# EAGLE design picoAvaRev2-1 (EAGLE 6.2)
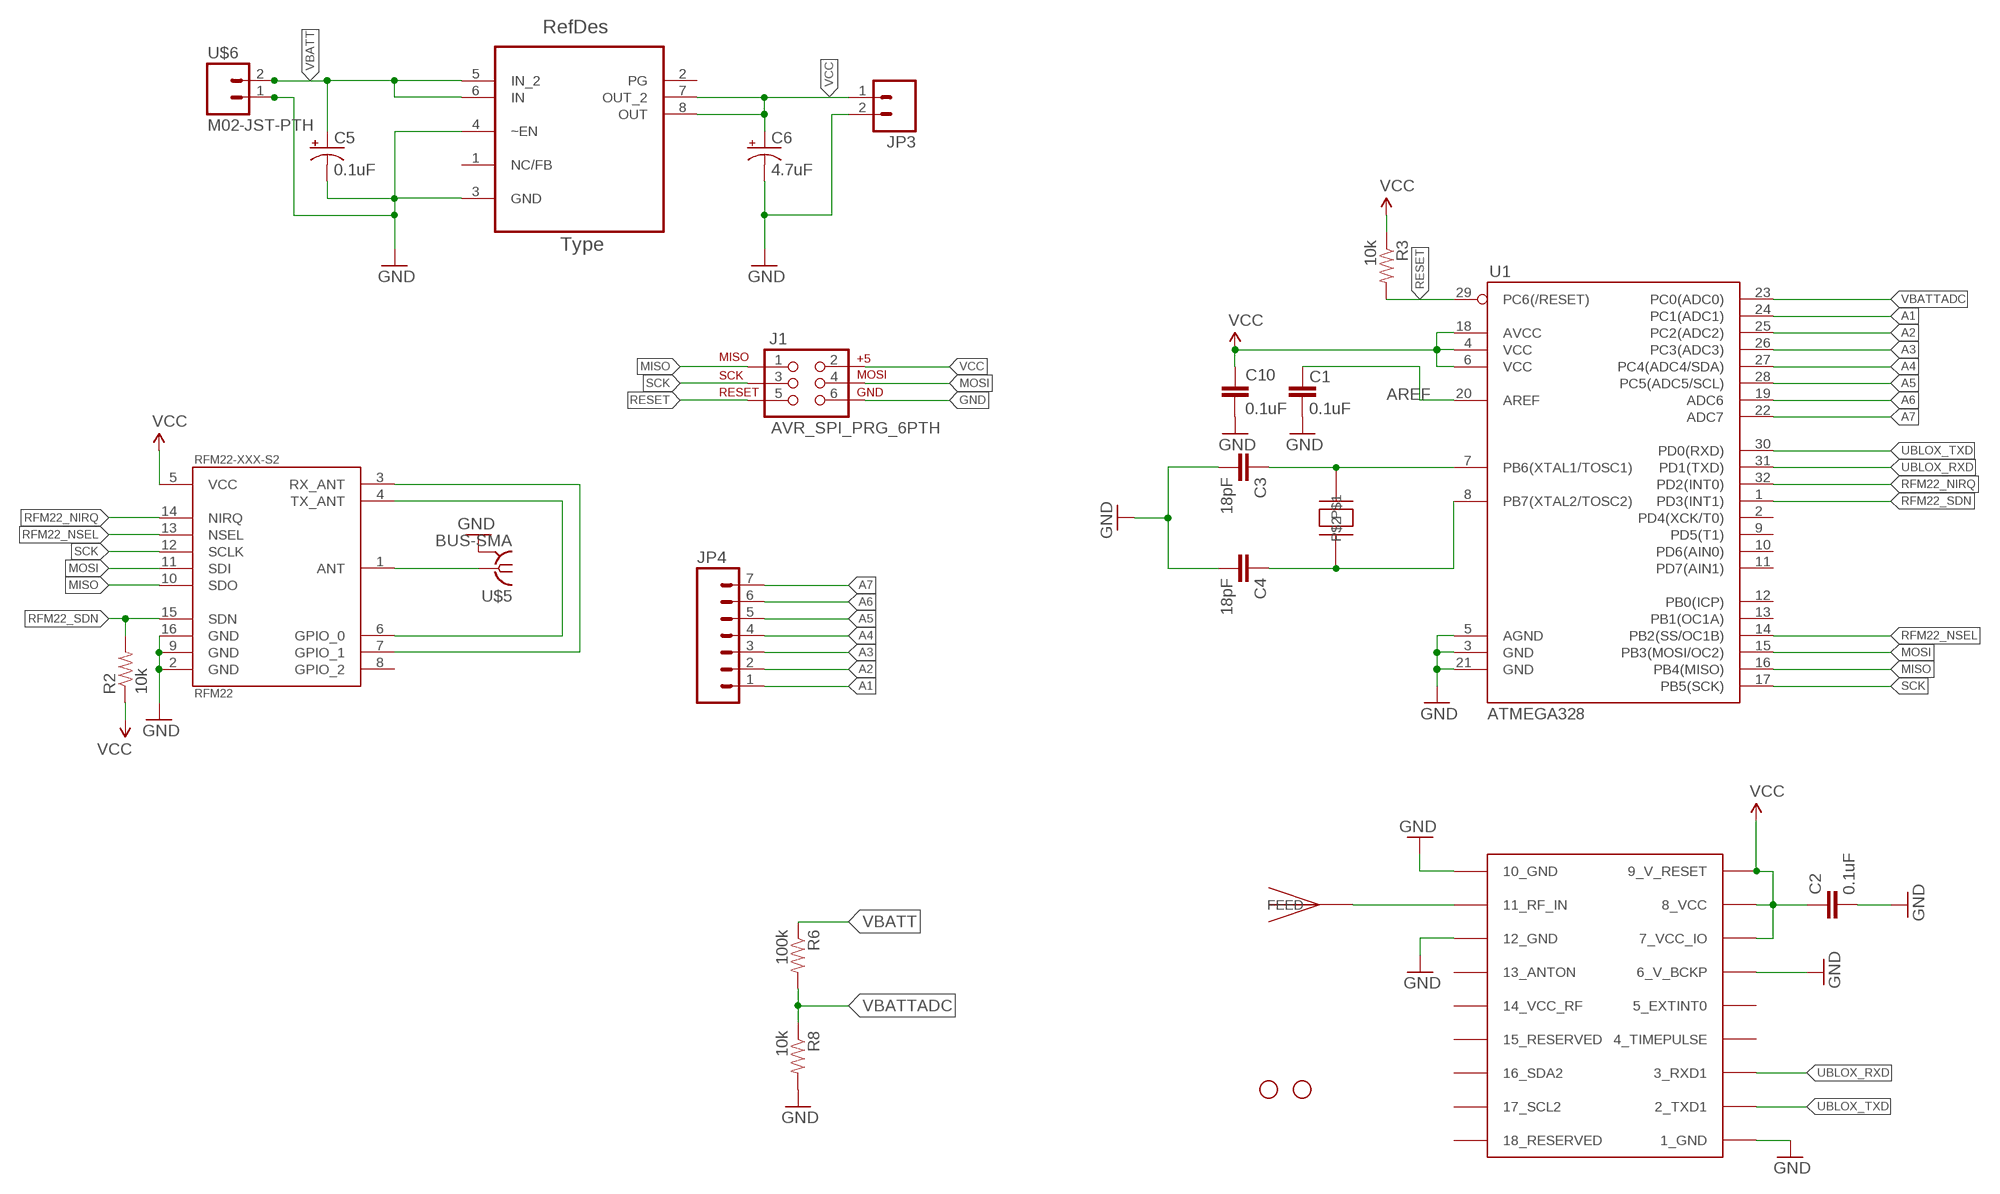
[diagram p0: schematic, sheet 1]

## Parts
C1  0.1uF  CAP0402-CAP  [0402-CAP]
C2  0.1uF  CAP0402-CAP  [0402-CAP]
C3  18pF  CAP0402-CAP  [0402-CAP]
C4  18pF  CAP0402-CAP  [0402-CAP]
C5  0.1uF  CAP_POL1206-KIT  [EIA3216-KIT]
C6  4.7uF  CAP_POL1206-KIT  [EIA3216-KIT]
C10  0.1uF  CAP0402-CAP  [0402-CAP]
J1  AVR_SPI_PRG_6PTH  [2X3]
JP1  STAND-OFF  [STAND-OFF]
JP2  STAND-OFF  [STAND-OFF]
JP3  M02PTH  [1X02]
JP4  M07  [1X07]
R2  10k  RESISTOR0402-RES  [0402-RES]
R3  10k  RESISTOR0402-RES  [0402-RES]
R6  100k  RESISTOR0402-RES  [0402-RES]
R8  10k  RESISTOR0402-RES  [0402-RES]
RFM22-XXX-S2  RFM22  [RFM22-XXX-S2]
U1  ATMEGA328  ATMEGA168  [TQFP32-08]
U2  TPS76633D  [SOIC127P600X175-8N]
U$1  UBLOX_MAX-6  [UBLOX_MAX-6]
U$2  ABRACON_ABM3_CRYSTAL  [ABRACON_ABM3_CRYSTAL]
U$3  JTI_ANTENNA-1575AT43A40  [JTI_ANTENNA-1575AT43A40]
U$5  BUS-SMA  [BUS-SMA]
U$6  M02-JST-PTH  [M02-JST-PTH]

## Nets
3.3V: R3.1 ; supply symbol labelled VCC
A1: JP4.1 U1.24(PC1(ADC1))
A2: JP4.2 U1.25(PC2(ADC2))
A3: JP4.3 U1.26(PC3(ADC3))
A4: JP4.4 U1.27(PC4(ADC4/SDA))
A5: JP4.5 U1.28(PC5(ADC5/SCL))
A6: JP4.6 U1.19(ADC6)
A7: JP4.7 U1.22(ADC7)
AREF: C1.2 U1.20(AREF)
GND [vcc]: C1.1 C2.2 C3.2 C4.2 C5.C(-) C6.C(-) C10.2 J1.6 JP3.2 R8.2 RFM22-XXX-S2.2(GND) RFM22-XXX-S2.9(GND) RFM22-XXX-S2.16(GND) U1.3(GND) U1.5(AGND) U1.21(GND) U2.3(GND) U2.4(~EN) U$1.1_GND U$1.6_V_BCKP U$1.10_GND U$1.12_GND U$5.2(GND) U$5.3(GND) U$5.4(GND) U$5.5(GND) U$6.1
MISO: J1.1 RFM22-XXX-S2.10(SDO) U1.16(PB4(MISO))
MOSI: J1.4 RFM22-XXX-S2.11(SDI) U1.15(PB3(MOSI/OC2))
N$3: RFM22-XXX-S2.1(ANT) U$5.1
N$4: U$1.11_RF_IN U$3.FEED
N$5: RFM22-XXX-S2.3(RX_ANT) RFM22-XXX-S2.7(GPIO_1)
N$6: RFM22-XXX-S2.4(TX_ANT) RFM22-XXX-S2.6(GPIO_0)
N$9: C3.1 U1.7(PB6(XTAL1/TOSC1)) U$2.P$2
N$10: C4.1 U1.8(PB7(XTAL2/TOSC2)) U$2.P$1
RESET: J1.5 R3.2 U1.29(PC6(/RESET))
RFM22_NIRQ: RFM22-XXX-S2.14(NIRQ) U1.32(PD2(INT0))
RFM22_NSEL: RFM22-XXX-S2.13(NSEL) U1.14(PB2(SS/OC1B))
RFM22_SDN: R2.2 RFM22-XXX-S2.15(SDN) U1.1(PD3(INT1))
SCK: J1.3 RFM22-XXX-S2.12(SCLK) U1.17(PB5(SCK))
UBLOX_RXD: U1.31(PD1(TXD)) U$1.3_RXD1
UBLOX_TXD: U1.30(PD0(RXD)) U$1.2_TXD1
VBATT [vcc]: C5.A(+) R6.1 U2.5(IN_2) U2.6(IN) U$6.2
VBATTADC: R6.2 R8.1 U1.23(PC0(ADC0))
VCC: C2.1 C6.A(+) C10.1 J1.2 JP3.1 R2.1 RFM22-XXX-S2.5(VCC) U1.4(VCC) U1.6(VCC) U1.18(AVCC) U2.7(OUT_2) U2.8(OUT) U$1.7_VCC_IO U$1.8_VCC U$1.9_V_RESET
Unconnected: RFM22-XXX-S2.8(GPIO_2) U1.2(PD4(XCK/T0)) U1.9(PD5(T1)) U1.10(PD6(AIN0)) U1.11(PD7(AIN1)) U1.12(PB0(ICP)) U1.13(PB1(OC1A)) U2.1(NC/FB) U2.2(PG) U$1.4_TIMEPULSE U$1.5_EXTINT0 U$1.13_ANTON U$1.14_VCC_RF U$1.15_RESERVED U$1.16_SDA2 U$1.17_SCL2 U$1.18_RESERVED

## Library data of the parts
C1-C4 C10 = SparkFun:CAP: Capacitor Standard 0603 ceramic capacitor, and 0.1" leaded capacitor.
C5 C6 = SparkFun:CAP_POL: Capacitor Polarized These are standard SMD and PTH capacitors. Normally 10uF, 47uF, and 100uF in electrolytic and tantalum varieties. Always verify the external diameter of the through hole cap, it varies with capacity, voltage, and manufacturer. The EIA devices should be standard.
J1 = SparkFun:AVR_SPI_PRG_6: AVR ISP 6 Pin This is the reduced ISP connector for AVR programming. Common on Arduino. This footprint will take up less PCB space and can be used with a 10-pin to 6-pin adapter such as SKU: BOB-08508
JP1 JP2 = SparkFun:STAND-OFF: Stand Off This is the mechanical footprint for a #4 phillips button head screw. Use the keepout ring to avoid running the screw head into surrounding components. SKU : PRT-00447
JP3 = SparkFun:M02: Header 2 Standard 2-pin 0.1" header. Use with straight break away headers (SKU : PRT-00116), right angle break away headers (PRT-00553), swiss pins (PRT-00743), machine pins (PRT-00117), and female headers (PRT-00115). Molex polarized connector foot print use with SKU : PRT-08233 with associated crimp pins and housings.
JP4 = SparkFun:M07: Header 7 Standard 7-pin 0.1" header. Use with straight break away headers (SKU : PRT-00116), right angle break away headers (PRT-00553), swiss pins (PRT-00743), machine pins (PRT-00117), and female headers (PRT-00115). NOTES ON THE VARIANTS LOCK and LOCK_LONGPADS... This footprint was designed to help hold the alignment of a through-hole component (i.e. 7-pin header) while soldering it into place. You may notice that each hole has been shifted either up or down by 0.005 of an inch from it's more standard position (which is usually a perfectly straight line). This slight alteration caused the pins (the squares in the middle) to touch the edges of the holes. Because they are alternating, it causes a "brace" to hold the header in place. 0.005 has proven to be the perfect amount of "off-center" position when using our standard breakaway headers. Although looks a little odd when you look at the bare footprint, once you have a header in there, the alteration is very hard to notice. Also, if you push a header all the way into place, it is covered up entirely on the bottom side. This idea of altering the position of holes to aid alignment will be further integrated into the Sparkfun Library for other footprints. It can help hold any component with 3 or more connection pins.
R2 R3 R6 R8 = SparkFun:RESISTOR: Resistor Basic schematic elements and footprints for 0603, 1206, and PTH resistors.
RFM22-XXX-S2 = SparkFun:RFM22: *Hope RF's RFM22* Packages: RFM22-S2 (SMD)
U1 = SparkFun:ATMEGA168
U2 = ava:TPS76633D; DESCRIPTION: ULTRALOW QUIESCENT CURRENT 250-mA LOW DROPOUT VOLTAGE REGULATORS; MPN: TPS76633D; OC_FARNELL: 8461422; OC_NEWARK: 77C1060; PACKAGE: SOIC-8; SUPPLIER: Texas Instruments
U$1 = ava:UBLOX_MAX-6: UBLOX MAX-6
U$2 = ava:ABRACON_ABM3_CRYSTAL
U$3 = ava:JTI_ANTENNA-1575AT43A40
U$5 = ava:BUS-SMA
U$6 = ava:M02-JST-PTH

## Net classes
0 default: width 0.203 mm
1 vcc: width 0.254 mm

## Board
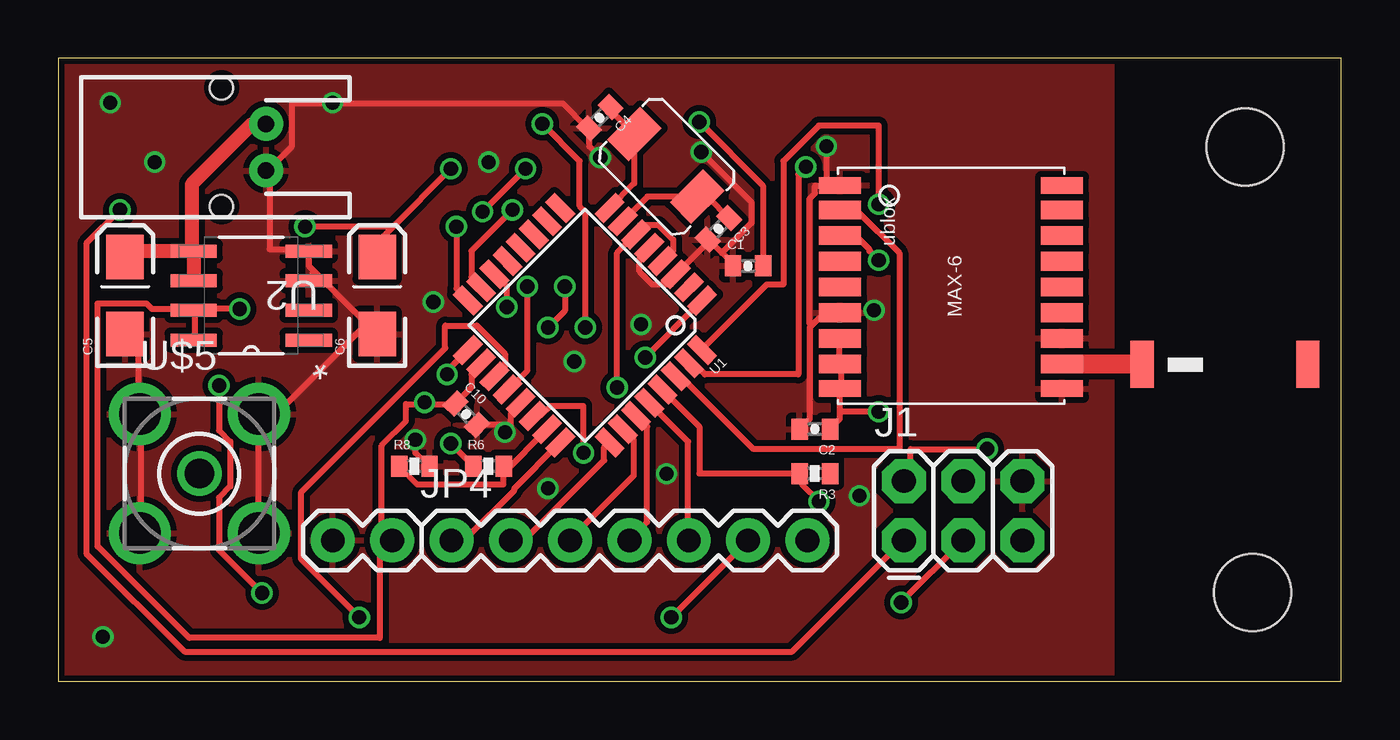
[diagram p1: board, top side]
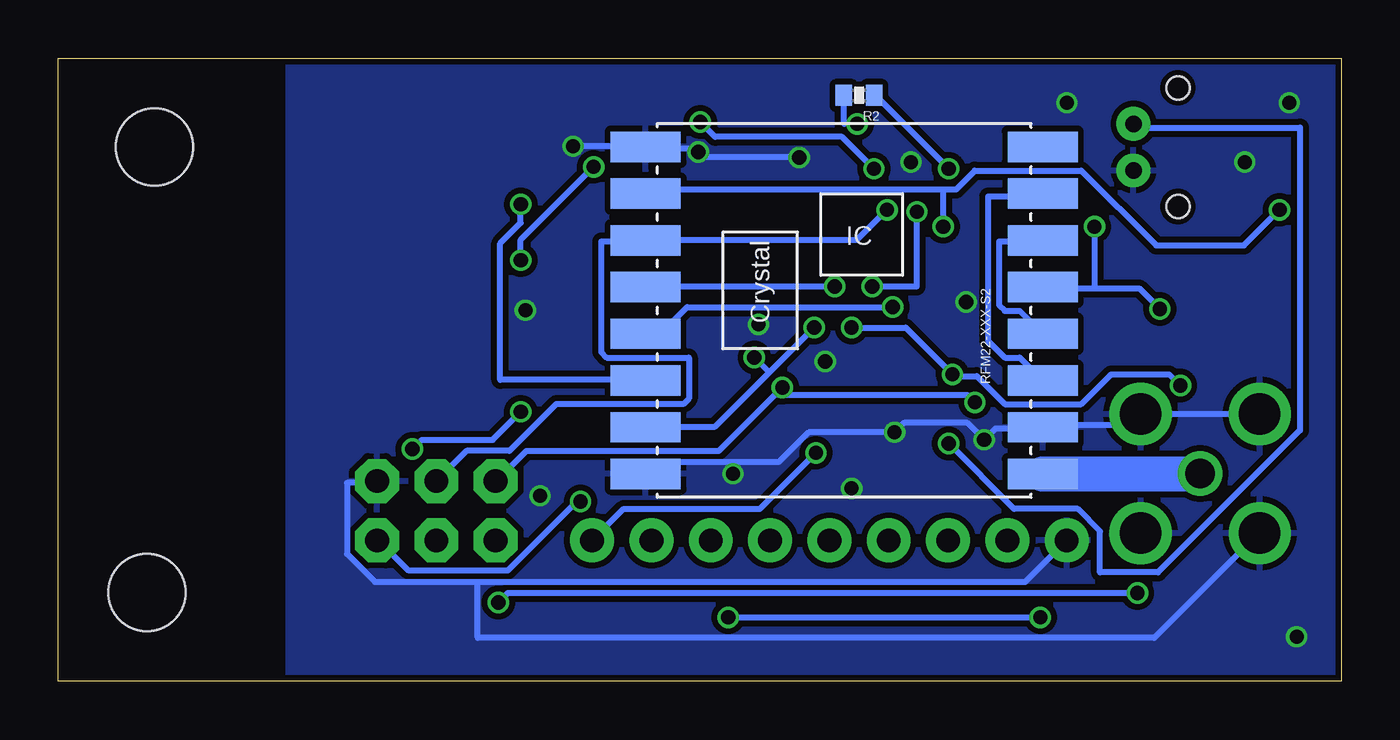
[diagram p2: board, bottom side, seen from below]

Size 54.91 x 26.66 mm. Coordinates in mm from the lower left corner, seen from the top.
Outline: 0,0 54.91,0 54.91,26.66 0,26.66 0,0
Copper layers (1*16): Top 0.035mm / dielectric 1.5mm / Bottom 0.035mm
Design rules: minimum track width 6mil, minimum drill 12mil, track to track 6mil, track to pad 6mil, pad to pad 6mil, via to via 6mil, smd to smd 0mil, copper to edge 10mil, drill to drill 10mil, minimum pad ring 10mil, minimum via ring 6mil, stop-mask expansion 2mil, vias tented up to drill 100mil, thermal gap 10mil

### Footprints (pad centres in the part's own frame; a part is rotated, then mirrored left to right if it is on the bottom)
0402-CAP = smd 0.7 x 0.9: 1 -0.65,0; 2 0.65,0
EIA3216-KIT = smd 1.9 x 1.6: A 1.65,0; C -1.65,0
2X3 = drill 1.016 pad 1.88 octagon: 1 0,0; 2 0,2.54; 3 2.54,0; 4 2.54,2.54; 5 5.08,0; 6 5.08,2.54
STAND-OFF = hole 3.302: 0,0
1X02 = drill 1.016 pad 1.88: 1 0,0; 2 2.54,0
1X07 = drill 1.016 pad 1.88: 1 0,0; 2 2.54,0; 3 5.08,0; 4 7.62,0; 5 10.16,0; 6 12.7,0; 7 15.24,0
0402-RES = smd 0.7 x 0.9: 1 -0.65,0; 2 0.65,0
RFM22-XXX-S2 = smd 3 x 1.3: 1 -8.5,7; 2 -8.5,5; 3 -8.5,3; 4 -8.5,1; 5 -8.5,-1; 6 -8.5,-3; 7 -8.5,-5; 8 -8.5,-7; 9 8.5,-7; 10 8.5,-5; 11 8.5,-3; 12 8.5,-1; 13 8.5,1; 14 8.5,3; 15 8.5,5; 16 8.5,7
TQFP32-08 = smd 1.27 x 0.559: 1 -4.293,2.8; 2 -4.293,2; 3 -4.293,1.2; 4 -4.293,0.4; 5 -4.293,-0.4; 6 -4.293,-1.2; 7 -4.293,-2; 8 -4.293,-2.8; 17 4.293,-2.8; 18 4.293,-2; 19 4.293,-1.2; 20 4.293,-0.4; 21 4.293,0.4; 22 4.293,1.2; 23 4.293,2; 24 4.293,2.8 | smd 0.559 x 1.27: 9 -2.8,-4.293; 10 -2,-4.293; 11 -1.2,-4.293; 12 -0.4,-4.293; 13 0.4,-4.293; 14 1.2,-4.293; 15 2,-4.293; 16 2.8,-4.293; 25 2.8,4.293; 26 2,4.293; 27 1.2,4.293; 28 0.4,4.293; 29 -0.4,4.293; 30 -1.2,4.293; 31 -2,4.293; 32 -2.8,4.293
SOIC127P600X175-8N = smd 1.981 x 0.559: 1 -2.464,1.905; 2 -2.464,0.635; 3 -2.464,-0.635; 4 -2.464,-1.905; 5 2.464,-1.905; 6 2.464,-0.635; 7 2.464,0.635; 8 2.464,1.905
UBLOX_MAX-6 = smd 1.8 x 0.7: 1_GND 4.95,-4.4; 9_V_RESET 4.95,4.3; 10_GND -4.55,4.3; 18_RESERVED -4.55,-4.4 | smd 1.8 x 0.8: 2_TXD1 4.95,-3.35; 3_RXD1 4.95,-2.25; 4_TIMEPULSE 4.95,-1.15; 5_EXTINT0 4.95,-0.05; 6_V_BCKP 4.95,1.05; 7_VCC_IO 4.95,2.15; 8_VCC 4.95,3.25; 11_RF_IN -4.55,3.25; 12_GND -4.55,2.15; 13_ANTON -4.55,1.05; 14_VCC_RF -4.55,-0.05; 15_RESERVED -4.55,-1.15; 16_SDA2 -4.55,-2.25; 17_SCL2 -4.55,-3.35
ABRACON_ABM3_CRYSTAL = smd 1.3 x 2: P$1 -3.4,0.1; P$2 0.4,0.1
JTI_ANTENNA-1575AT43A40 = smd 1 x 2: FEED -3.81,-1.27; NC 3.29,-1.27
BUS-SMA = drill 1.27: 1 0,0 | drill 1.778: 2 -2.55,2.55; 3 2.55,2.55; 4 2.55,-2.55; 5 -2.55,-2.55
M02-JST-PTH = drill 0.7 pad 1.448: 1 -1,0; 2 1,0 | hole 1: -2.54,1.905; 2.54,1.905

### Placement (x,y rotation side)
C1  29.53,17.78 0 top
C2  32.38,10.8 180 top
C3  28.26,19.37 225 top
C4  23.18,24.13 225 top
C5  2.86,16.51 90 top
C6  13.65,16.51 90 top
C10  17.46,11.43 315 top
J1  36.2,6.03 0 top
JP1  50.8,22.86 0 top
JP2  51.12,3.81 0 top
JP3  14.29,6.03 180 top
JP4  16.83,6.03 0 top
R2  20.64,25.08 180 bottom
R3  32.38,8.89 180 top
R6  18.41,9.21 0 top
R8  15.24,9.21 0 top
RFM22-XXX-S2  21.27,15.88 180 bottom
U1  22.54,15.24 225 top
U2  8.26,16.51 180 top
U$1  38.42,16.83 180 top
U$2  26.99,20.95 315 top
U$3  50.2,14.84 0 top
U$5  6.03,8.89 0 top
U$6  8.89,22.86 90 top

### Tracks (layer width: path | path; a pad name or v marks a point on that pad's centre or on a via)
A1
  Top 0.254: U1.24 21.44,10.18 19.52,8.26 19.52,8.18 17.44,6.1 16.88,6.1 JP4.1
A2
  Top 0.254: U1.25 23.52,10.18 23.36,10.02 23.36,9.46 20,6.1 19.44,6.1 JP4.2
A3
  Top 0.254: U1.26 24.24,10.74 24.64,10.34 24.64,8.82 21.92,6.1 JP4.3
A4
  Top 0.254: U1.27 24.8,11.3 25.2,10.9 25.2,6.82 24.48,6.1 JP4.4
A5
  Top 0.254: U1.28 25.36,11.86 26.96,10.26 26.96,6.1 JP4.5
A6  (via drill 0.61)
  Top 0.254: v12.88,2.74 10.4,5.22 10.4,8.1 16.56,14.26 16.56,15.22 17.92,15.22 19.12,14.02 19.12,13.46 18.72,13.06 U1.19 | v26.24,2.74 JP4.6
  Bottom 0.254: v26.24,2.74 v12.88,2.74
A7  (via drill 0.61)
  Top 0.254: v22.48,9.78 22.48,11.78 21.04,11.78 20.64,11.38 20.4,11.38 U1.22
  Bottom 0.254: v22.48,9.78 24.88,7.38 30.72,7.38 JP4.7
AREF  (via drill 0.61)
  Top 0.254: v27.44,23.94 30.16,21.22 30.16,17.78 C1.2 | v18.16,20.1 v20,21.94 | v20.08,16.9 20.08,13.3 19.28,12.5 U1.20
  Bottom 0.254: v27.44,23.94 26.8,23.3 21.36,23.3 v20,21.94 | v18.16,20.1 18.16,16.9 v20.08,16.9
GND  (via drill 0.6, 0.61)
  Top 0.254: C2.2 32.16,11.22 32.16,15.14 32.24,15.22 | 32.24,15.22 32.72,15.7 33.44,15.7 U$1.6_V_BCKP | 32.24,15.22 32.16,15.3 32.16,20.66 32.4,20.9 32.4,21.22 33.44,21.22 U$1.1_GND 32.88,21.3 v32.88,22.9 | 28.4,18.34 28.8,17.94 28.8,17.78 C1.1 | 28.4,18.34 27.84,18.9 C3.2 27.76,18.82 27.76,18.74 26.48,17.46 U1.3 26.32,17.38 26.24,17.3 26.24,16.98 25.44,16.98 24.88,17.54 24.88,18.1 25.28,18.5 U1.5 | 28.4,18.34 29.68,19.62 29.68,20.5 v27.52,22.66 | 10.96,17.54 10.72,17.78 10.72,18.34 U2.4 10.64,18.5 9.04,18.5 9.04,21.78 U$6.1 8.96,21.86 10,22.9 10,24.74 21.6,24.74 22.64,23.7 C4.2 22.72,23.54 22.72,22.9 v23.2,22.42 | 10.96,17.54 13.6,14.9 C6.C 13.12,15.22 8.64,10.74 U$5.3 8.56,11.38 8.56,6.42 U$5.4 | U2.3 10.72,17.22 10.88,17.38 10.88,17.46 10.96,17.54 | C5.C 2.88,14.82 3.44,14.26 3.44,11.46 U$5.2 3.52,11.38 3.52,6.42 U$5.5 | 19.12,10.98 19.36,10.98 19.36,11.46 19.76,11.86 U1.21 | 19.12,10.98 18,10.98 C10.2 | v15.28,10.34 15.28,9.78 15.84,9.22 R8.2 | v19.12,10.66 19.12,10.98
  Bottom 0.254: JP3.2 13.52,4.26 36.96,4.26 | 36.96,4.26 41.36,4.26 42.56,5.46 42.56,8.5 41.28,8.5 J1.6 | v32.88,22.9 29.84,22.9 RFM22-XXX-S2.9 29.76,22.82 27.68,22.82 v27.52,22.66 27.28,22.42 v23.2,22.42 | RFM22-XXX-S2.16 29.76,8.9 29.28,9.38 24.08,9.38 22.8,10.66 v19.12,10.66 18.72,11.06 16,11.06 v15.28,10.34 14.8,10.82 12.8,10.82 RFM22-XXX-S2.2 12.72,10.98 9.04,10.98 8.64,11.38 U$5.3 8.48,11.46 3.52,11.46 U$5.2 | 36.96,4.26 36.96,1.86 8,1.86 3.52,6.34 U$5.5
  other vias: 2.22,24.77 4.13,22.22 11.75,24.77 18.41,22.22 20.95,8.25 26.04,8.89 34.92,15.88 34.29,7.94 22.09,13.69 24.94,15.28 16.05,16.23 1.91,1.9
  pour Top (isolate 0.254): 0,26.67 45.09,26.67 45.09,0 0,0
  pour Bottom (isolate 0.254): 0,26.67 45.09,26.67 45.09,0 0,0
MISO  (via drill 0.61)
  Top 0.254: v17.04,19.46 17.04,16.82 17.52,16.34 U1.16 | v2.64,20.18 1.2,18.74 1.2,5.47 5.4,1.27 31.41,1.27 36.16,6.02 J1.1
  Bottom 0.254: 17.04,21.06 v17.04,19.46 | 17.04,21.06 29.6,21.06 29.76,20.9 RFM22-XXX-S2.10 | v2.64,20.18 4.16,18.66 7.92,18.66 11.12,21.86 15.68,21.86 16.48,21.06 17.04,21.06
MOSI  (via drill 0.61)
  Top 0.254: v19.44,20.18 17.68,18.42 17.68,17.3 18.08,16.9 U1.15
  Bottom 0.254: v19.44,20.18 20.72,18.9 29.76,18.9 RFM22-XXX-S2.11 29.84,18.82 31.68,18.82 31.68,14.1 31.44,13.86 27.92,13.86 27.92,12.1 28.16,11.86 33.6,11.86 35.6,9.86 37.44,9.86 J1.4
N$3
  Bottom 0.813: 6.03,8.88 U$5.1
  Bottom 1.5: RFM22-XXX-S2.1 6.03,8.88
N$4
  Top 0.254: 43.21,13.58 U$1.11_RF_IN
  Top 0.813: U$3.FEED 43.21,13.58
N$5
  Bottom 0.254: RFM22-XXX-S2.3 12.8,12.9 13.76,13.86 14.4,13.86 15.12,14.58 15.12,20.74 12.88,20.74 12.8,20.82 RFM22-XXX-S2.7
N$6
  Bottom 0.254: RFM22-XXX-S2.4 12.8,14.9 13.76,15.86 14.4,15.86 14.64,16.1 14.64,18.82 12.8,18.82 RFM22-XXX-S2.6
N$9
  Top 0.254: U1.7 25.22,20.74 U$2.P$2 27.8,20.74 C3.1
N$10
  Top 0.254: U1.8 24.65,21.31 U$2.P$1 23.64,24.45 C4.1
RESET  (via drill 0.61)
  Top 0.254: U1.29 25.92,12.42 27.44,10.9 27.44,8.9 31.68,8.9 R3.2 31.84,8.82 31.84,8.42 v32.56,7.7
  Bottom 0.254: v32.56,7.7 32.72,7.7 35.68,4.74 39.92,4.74 41.2,6.02 J1.5
RFM22_NIRQ  (via drill 0.61)
  Top 0.254: v35.12,20.42 35.12,23.78 32.56,23.78 31.04,22.26 31.04,16.98 30.32,16.98 27.6,14.26 U1.32
  Bottom 0.254: v35.12,20.42 35.12,19.62 36,18.74 36,12.9 29.84,12.9 RFM22-XXX-S2.14
RFM22_NSEL  (via drill 0.61)
  Top 0.254: v19.2,16.02 19.2,16.9 18.72,17.38 U1.14
  Bottom 0.254: v19.2,16.02 28,16.02 29.12,14.9 29.76,14.9 RFM22-XXX-S2.13
RFM22_SDN  (via drill 0.61)
  Top 0.254: v20.72,23.86 22.32,22.26 22.32,20.34 22.56,20.1 v22.56,15.14 | v25.12,13.86 27.52,16.26 U1.1
  Bottom 0.254: v20.72,23.86 21.28,23.86 21.28,25.06 R2.2 | 24.48,13.22 26.8,10.9 29.76,10.9 RFM22-XXX-S2.15 | 24.48,13.22 v22.56,15.14 | 24.48,13.22 v25.12,13.86
SCK  (via drill 0.61)
  Top 0.254: v16.64,13.14 16.64,13.3 U1.17 | v20.96,15.14 21.68,15.86 v21.68,16.9 | v36.08,3.38 J1.3 | v8.72,3.78 6.88,5.62 6.88,7.86 7.36,8.34 7.36,10.26 6.88,10.74 v6.88,12.66
  Bottom 0.254: v20.96,15.14 18.64,15.14 v16.64,13.14 16.56,13.06 15.6,13.06 14.4,11.86 11.12,11.86 9.84,13.14 7.36,13.14 v6.88,12.66 | v21.68,16.9 29.76,16.9 RFM22-XXX-S2.12 | v36.08,3.38 35.68,3.78 v8.72,3.78
UBLOX_RXD  (via drill 0.61)
  Top 0.254: v32,22.02 31.68,21.7 31.68,13.14 27.68,13.14 27.28,13.54 27.04,13.54 U1.31 | v35.12,18.02 34.72,18.42 34.72,18.5 34.16,19.06 33.52,19.06 U$1.3_RXD1
  Bottom 0.254: v32,22.02 35.12,18.9 v35.12,18.02
UBLOX_TXD
  Top 0.254: U1.30 26.48,12.98 26.72,12.98 29.76,9.94 36,9.94 36,18.34 34.24,20.1 33.52,20.1 U$1.2_TXD1
VBATT  (via drill 0.61)
  Top 0.254: v16.8,10.18 R6.1
  Top 0.61: U$6.2 8.3,23.86 5.71,21.27 5.71,18.49 U2.5 | U2.5 U2.6 | U2.5 3.11,18.41 C5.A
  Bottom 0.254: v16.8,10.18 14,7.38 11.28,7.38 10.32,6.42 10.32,4.66 7.84,4.66 1.76,10.74 1.76,23.7 8.72,23.7 U$6.2
VBATTADC
  Top 0.254: R8.1 14.64,9.14 15.36,8.42 19.04,8.42 19.04,9.14 R6.2 19.12,8.98 20.88,10.74 U1.23
VCC  (via drill 0.61)
  Top 0.254: U2.8 5.84,14.66 5.84,15.86 U2.7 | v7.76,15.94 5.92,15.94 U2.7 | 14.24,19.38 13.68,18.82 13.68,18.18 C6.A | 14.24,19.38 v16.8,21.94 | v10.56,19.46 14.16,19.46 14.24,19.38 | U1.18 18.08,13.54 17.68,13.14 17.68,12.58 17.04,11.94 C10.1 16.88,11.86 15.68,11.86 | 15.68,11.86 14.88,11.86 14.88,11.14 13.84,10.1 13.84,6.5 14.24,6.1 JP3.1 13.76,6.42 13.76,1.86 5.6,1.86 1.68,5.78 1.68,16.18 3.76,16.18 4,15.94 5.68,15.94 U2.7 | 33.44,11.54 33.44,12.5 U$1.9_V_RESET 33.52,12.58 33.52,13.54 U$1.8_VCC 33.44,13.7 33.44,14.66 U$1.7_VCC_IO | 33.44,11.54 33.44,11.22 33.04,10.82 C2.1 | U1.4 25.92,18.02 26.32,18.42 26.32,18.9 25.68,19.54 24.88,19.54 24.88,19.22 24.8,19.14 U1.6 24.64,19.06 23.92,18.34 v23.92,12.58 | v35.12,11.54 33.44,11.54 | v39.76,9.94 36.48,9.94 36.48,8.82 36.24,8.58 J1.2 | v15.68,11.94 15.68,11.86
  Bottom 0.254: v7.76,15.94 8.64,16.82 10.56,16.82 | 10.56,16.82 12.72,16.82 RFM22-XXX-S2.5 | v16.8,21.94 19.92,25.06 R2.1 | v10.56,19.46 10.56,16.82 | J1.2 36.16,8.58 34.88,9.86 26.64,9.86 v23.92,12.58 24.08,12.26 16,12.26 v15.68,11.94 | v35.12,11.54 36.32,10.34 39.36,10.34 v39.76,9.94